# Altium schematic sheet [04] - USB PORTS.SchDoc
size A3; SheetNumber: 4; SheetTotal: 9
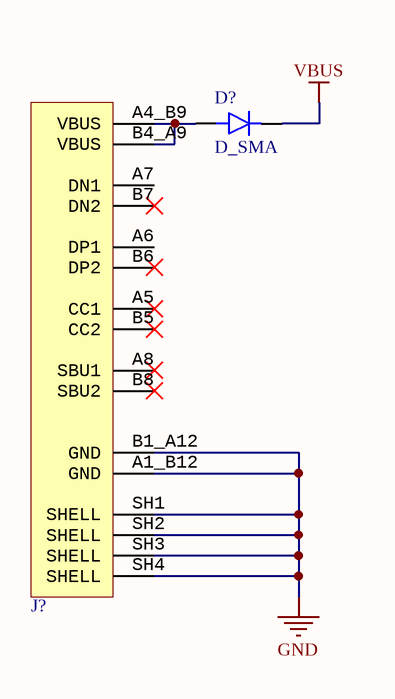
[diagram p0: [04] - USB PORTS.SchDoc]

## Parts
D?  D_SMA  [DO-214AC-2 (SMA)]
J?  CONN_USB_TYPEC_16PIN  [CONN_USB_TYPEC_16PIN]  (value not drawn)

## Nets
GND: J?.A1_B12(GND) J?.B1_A12(GND) J?.SH1(SHELL) J?.SH2(SHELL) J?.SH3(SHELL) J?.SH4(SHELL)
VBUS: D?.K
NetD?_A: D?.A J?.A4_B9(VBUS) J?.B4_A9(VBUS)

Not connected (* = marked no-connect by the designer): J? A5(CC1)* A6(DP1) A7(DN1) A8(SBU1)* B5(CC2)* B6(DP2)* B7(DN2)* B8(SBU2)*

## Library data of the parts
D? = D_SMA: Diode SMD SMA (DO-214AA)
J? = CONN_USB_TYPEC_16PIN: USB-C (USB TYPE-C) USB 2.0 Receptacle Connector 24 (16+8 Dummy) Position Surface Mount, Right Angle; Through Hole; MP: USB4105-GF-A; Value: USB-C 2.0 24-Pin (16+8 Dummy); Package: None; Price: None; Availability: Unavailable; ComponentLink1Description: Buy; ComponentLink1URL: https://www.thegioiic.com/cong-usb-cai-3-1-type-c-16-chan-thang-dan-smd; Supplier: N/A; Supplier PN: N/A; Supplier URL: *